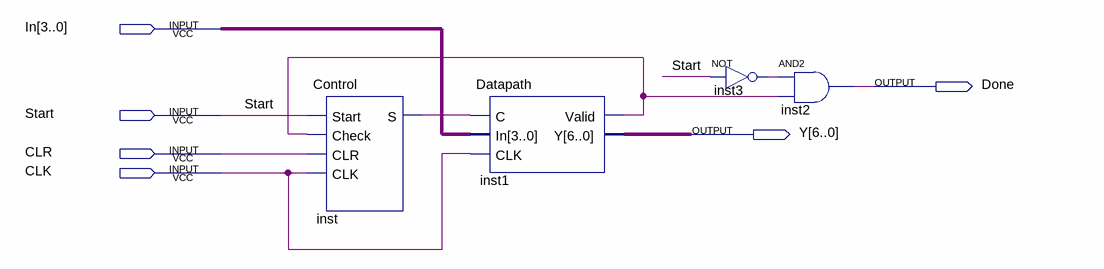
[diagram p0: schematic sheet]
// Quartus schematic Tong1_9.bdf as structural Verilog: 4 symbols, 6 pins
module Tong1_9 (
  input  [3:0] In,
  input  Start,
  input  CLR,
  input  CLK,
  output Done,
  output [6:0] Y
);

  wire inst1_valid, inst3_out, inst_s;

  Control inst (.Start(Start), .Check(inst1_valid), .CLR(CLR), .CLK(CLK), .S(inst_s));
  Datapath inst1 (.C(inst_s), .In(In), .CLK(CLK), .Valid(inst1_valid), .Y(Y));
  not inst3 (inst3_out, Start);
  and inst2 (Done, inst3_out, inst1_valid);
endmodule
